# Altium schematic sheet Encoder_Interface.SchDoc
size A4; CompanyName: Technische Hochschule Nürnberg Georg Simon Ohm; Organization: UltraZohm; Address1: Kesslerplatz 12; Address2: 90489 Nürnberg; Address3: GERMANY; DocumentNumber: 3; SheetNumber: 3; SheetTotal: 3; Website: www.ultrazohm.com
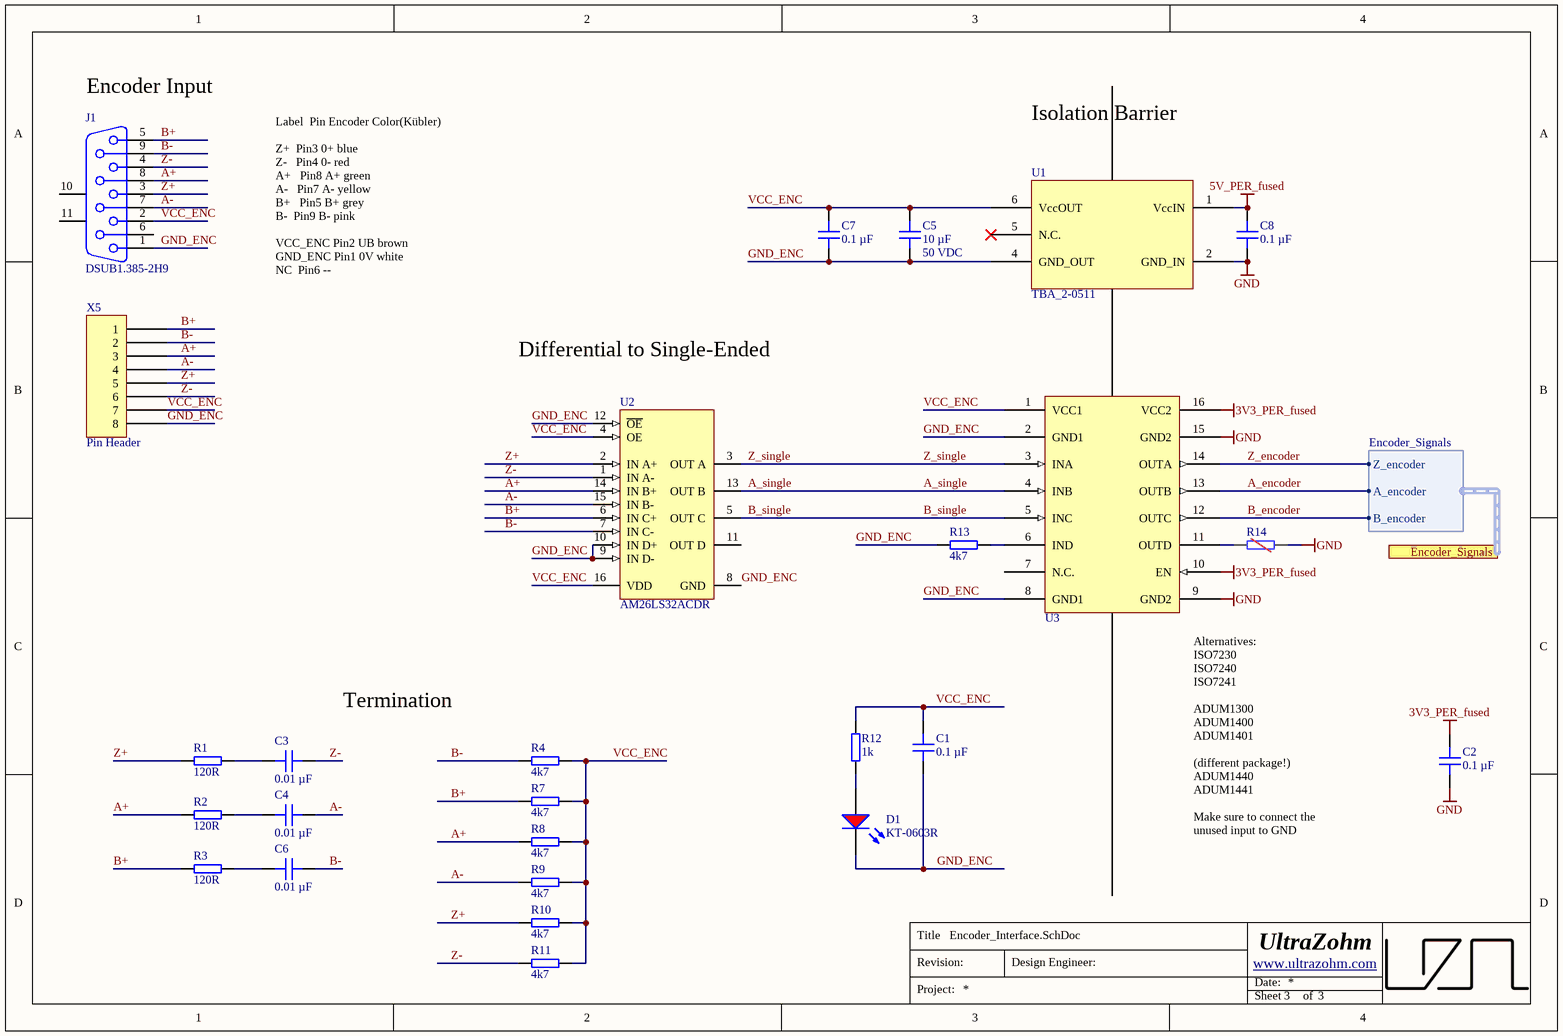
[diagram p0: Encoder_Interface.SchDoc]

## Parts
C1  0.1 µF  [C_0805]
C2  0.1 µF  [C_0805]
C3  0.01 µF  [C_0805]
C4  0.01 µF  [C_0805]
C5  10 µF  Voltage Rating: 50 VDC  [C_1206]
C6  0.01 µF  [C_0805]
C7  0.1 µF  [C_0805]
C8  0.1 µF  [C_0805]
D1  KT-0603R  [WL-SMCW_0603]
J1  DSUB1.385-2H9  [DSUB1.385-2H9]
R1  120R  [RES 0603_1608]
R2  120R  [RES 0603_1608]
R3  120R  [RES 0603_1608]
R4  4k7  [RES 0603_1608]
R7  4k7  [RES 0603_1608]
R8  4k7  [RES 0603_1608]
R9  4k7  [RES 0603_1608]
R10  4k7  [RES 0603_1608]
R11  4k7  [RES 0603_1608]
R12  1k  [RES 0603_1608]
R13  4k7  [RES 0603_1608]
R14  DNP  [R_0603_TE-DNP]  (value not drawn)  (no BOM)
U1  TBA_2-0511  [SIP7]
U2  AM26LS32ACDR  [D0016A_M]
U3  ISO7240MDWR  [SOIC-16]  (value not drawn)
X5  Pin Header  [HDR1X8]

## Ports
Encoder_Signals (harness Encoder_Signals)

## Harnesses
Encoder_Signals: A_encoder, B_encoder, Z_encoder

## Nets
3V3_PER_fused: C2.2 U3.10(EN) U3.16(VCC2)
5V_PER_fused: C8.2 U1.1(VccIN)
GND: C2.1 C8.1 R14.2 U1.2(GND_IN) U3.9(GND2) U3.15(GND2)
A+: J1.8 R2.1 R8.1 U2.14(IN_B+) X5.3
A-: C4.2 J1.7 R9.1 U2.15(IN_B-) X5.4
A_encoder: U3.13(OUTB) ; port Encoder_Signals.A_encoder
A_single: U2.13(OUT_B) U3.4(INB)
B+: J1.5 R3.1 R7.1 U2.6(IN_C+) X5.1
B-: C6.2 J1.9 R4.1 U2.7(IN_C-) X5.2
B_encoder: U3.12(OUTC) ; port Encoder_Signals.B_encoder
B_single: U2.5(OUT_C) U3.5(INC)
GND_ENC: C1.1 C5.1 C7.1 D1.1(K) J1.1 R13.1 U1.4(GND_OUT) U2.8(GND) U2.9(IN_D-) U2.10(IN_D+) U2.12(~{OE}) U3.2(GND1) U3.8(GND1) X5.8
VCC_ENC: C1.2 C5.2 C7.2 J1.2 R4.2 R7.2 R8.2 R9.2 R10.2 R11.2 R12.2 U1.6(VccOUT) U2.4(OE) U2.16(VDD) U3.1(VCC1) X5.7
Z+: J1.3 R1.1 R10.1 U2.2(IN_A+) X5.5
Z-: C3.2 J1.4 R11.1 U2.1(IN_A-) X5.6
Z_encoder: U3.14(OUTA) ; port Encoder_Signals.Z_encoder
Z_single: U2.3(OUT_A) U3.3(INA)
NetC3_1: C3.1 R1.2
NetC4_1: C4.1 R2.2
NetC6_1: C6.1 R3.2
NetD1_2: D1.2(A) R12.1
NetR13_2: R13.2 U3.6(IND)
NetR14_1: R14.1 U3.11(OUTD)

Not connected (* = marked no-connect by the designer): J1 6 10(MH1) 11(MH2); U1 5(N.C.)*; U2 11(OUT_D); U3 7(N.C.)

## Notes on the sheet
- (near J1) Encoder Input
- Isolation Barrier
- Label		Pin	Encoder	Color(Kübler)
  Z+		Pin3	0+	blue
  Z- 		Pin4	0-	red
  A+ 		Pin8	A+	green
  A- 		Pin7	A-	yellow
  B+ 		Pin5	B+	grey
  B-		Pin9	B-	pink
  VCC_ENC	Pin2	UB	brown
  GND_ENC	Pin1	0V	white
  NC		Pin6	--
- Differential to Single-Ended
- Termination
- (near U3) Alternatives:
  ISO7230
  ISO7240
  ISO7241
  ADUM1300
  ADUM1400
  ADUM1401
  (different package!)
  ADUM1440
  ADUM1441
  Make sure to connect the unused input to GND
- Title
- Revision:
- Design Engineer:
- Date:
- Project:
- Sheet
- of

## Library data of the parts
C1 C2 C7 C8 = C0805C104J5RECTU: Capacitor 0805, 50 VDC, 0.1 µF, X7R; Manufacturer: KEMET; Tolerance: 5 %; Voltage Rating: 50 VDC; Created from: MGremer; Manufacturer Part Number: C0805C104J5RECTU; PartID: 17; Created On: 20.12.2020 13:54:13; ComponentLink1Description: Datasheet; ComponentLink1URL: https://www.mouser.de/datasheet/2/212/KEM_C1002_X7R_SMD-1102033.pdf; Component Type: Capacitor 0805; Device Package: 0805; Last Updated: 27.05.2022 20:15:41; Mounting Type: SMD; Operating Temperature: -55 - 125°C; Series: SMD Comm X7R; Supplier 1: Mouser; Supplier Part Number 1: 80-C0805C104J5RECTU; Type: Capacitor; Value: 0.1 µF; Live Cycle Status: 1; Stock number: Labor SMD Container; LCSC Part Number: C49678
C3 C4 C6 = C0805X103K5RAC3316: Capacitor 0805, 50 VDC, 0.01 µF, X7R; Manufacturer: KEMET; Tolerance: 10 %; Voltage Rating: 50 VDC; Created from: MGremer; Manufacturer Part Number: C0805X103K5RAC3316; PartID: 21; Created On: 20.12.2020 13:54:13; ComponentLink1Description: Datasheet; ComponentLink1URL: https://www.mouser.de/datasheet/2/212/KEM_X7R_FT_VW_AUDI-1775098.pdf; Component Type: Capacitor 0805; Device Package: 0805; Last Updated: 27.05.2022 20:11:47; Mounting Type: SMD; Operating Temperature: -55 - 125°C; Series: SMD Comm X7R; Supplier 1: Mouser; Supplier Part Number 1: 80-C0805X103K5RC3316; Type: Capacitor; Value: 0.01 µF; Live Cycle Status: 1; Stock number: Labor SMD Container; LCSC Part Number: C1710
C5 = CGA5L1X7R1H106K160AC: Capacitor 1206, 50 VDC, 10 µF, X7R; Manufacturer: TDK; Tolerance: 10 %; Created from: MGremer; Manufacturer Part Number: CGA5L1X7R1H106K160AC; PartID: 25; Created On: 20.12.2020 13:54:13; ComponentLink1Description: Datasheet; ComponentLink1URL: https://product.tdk.com/info/en/catalog/datasheets/mlcc_automotive_general_en.pdf; Component Type: Capacitor 1206; Device Package: 1206; Last Updated: 27.05.2022 14:15:21; Mounting Type: SMD; Operating Temperature: -55 - 125°C; Series: CGA; Supplier 1: Mouser; Supplier Part Number 1: 810-CGA5L1X7R1H106K1; Type: Capacitor; Value: 10 µF; Live Cycle Status: 1; LCSC Part Number: C13585; Stock number: Labor SMD Container
D1 = KT-0603R: LED RED 520~625NM 90~100MCD@20MA TOP VIEW 0603 ROHS; Manufacturer: Hubei KENTO Elec; Type: Standard; Created from: T. Wendt; Forward Current I_f: 20 mA; Forward Voltage U_f: 2.1 V; Wavelength: 620 nm; Light Intensity: 110 mcd; Nominal Power: 42 mW; Manufacturer Part Number: KT-0603R; PartID: 8; Created On: 03.03.2021 10:06:23; ComponentLink1Description: Datasheet; ComponentLink1URL: https://datasheet.lcsc.com/szlcsc/Hubei-KENTO-Elec-KT-0603R_C2286.pdf; Component Type: LED Diode; Device Package: 0603; Last Updated: 04.03.2021 09:02:49; Mounting Type: SMD; Operating Temperature: -40 - 85 °C; Supplier 1: LCSC; Supplier Part Number 1: C2286; Live Cycle Status: 1; Stock number: not stored; Color: red; LCSC Part Number: C2286
J1 = DSUB1.385-2H9: Connector; D Subminiature; 9 Position; Right Angle; Pitch 1.385 mm; Manufacturer: TE Connectivity; PackageDocument: O; Positions: 9; Gender: Receptacle; Created from: MHlatky; Published: 15-Jun-2001; LatestRevisionDate: 17-Jul-2002; LatestRevisionNote: Re-released for DXP Platform.; DatasheetDocument: 1-Sep-1999; PackageReference: 788750; Publisher: Altium Limited; Orientation: Right Angle; Manufacturer Part Number: DSUB1.385-2H9; PartID: 5; Created On: 26.01.2021 09:19:51; ComponentLink1Description: Datasheet; ComponentLink1URL: https://www.mouser.de/datasheet/2/418/7/ENG_CD_2311765_D-2072985.pdf; Component Type: DSUB Connector; Device Package: -; Last Updated: 27.05.2022 15:54:50; Type: DSUB Connector; Live Cycle Status: 1; Stock number: not stored; Supplier 1: Mouser; Supplier Part Number 1: 571-2311765-1; LCSC Part Number: C141882
R1-R3 = RK73B1JTTD121J: SMD resistor E24 series; Manufacturer: KOA Speer; Tolerance: 5%; Created from: MGremer; Manufacturer Part Number: RK73B1JTTD121J; PartID: 52; Created On: 14.12.2020 16:17:14; ComponentLink1Description: Datasheet; ComponentLink1URL: https://www.mouser.de/datasheet/2/219/RK73B-1825463.pdf; Component Type: SMD resistor; Device Package: 0603; Last Updated: 27.05.2022 13:40:47; Mounting Type: SMD; Supplier 1: Mouser; Supplier Part Number 1: 660-RK73B1JTTD121J; Type: Resistor; Value: 120R; Live Cycle Status: 1; Stock number: Labor SMD Container; LCSC Part Number: C22787
R4 R7-R11 R13 = RK73B1JTTD472J: SMD resistor E24 series; Manufacturer: KOA Speer; Tolerance: 5%; Created from: MGremer; Manufacturer Part Number: RK73B1JTTD472J; PartID: 90; Created On: 14.12.2020 16:17:14; ComponentLink1Description: Datasheet; ComponentLink1URL: https://www.mouser.de/datasheet/2/219/RK73B-1825463.pdf; Component Type: SMD resistor; Device Package: 0603; Last Updated: 27.05.2022 13:46:16; Mounting Type: SMD; Supplier 1: Mouser; Supplier Part Number 1: 660-RK73B1JTTD472J; Type: Resistor; Value: 4k7; Live Cycle Status: 1; Stock number: Labor SMD Container; LCSC Part Number: C23162
R12 = RK73B1JTTDD102J: SMD resistor E24 series; Manufacturer: KOA Speer; Tolerance: 5%; Created from: MGremer; Manufacturer Part Number: RK73B1JTTDD102J; PartID: 74; Created On: 14.12.2020 16:17:14; ComponentLink1Description: Datasheet; ComponentLink1URL: https://www.mouser.de/datasheet/2/219/RK73B-1825463.pdf; Component Type: SMD resistor; Device Package: 0603; Last Updated: 27.05.2022 13:40:21; Mounting Type: SMD; Supplier 1: Mouser; Supplier Part Number 1: 660-RK73B1JTTDD102J; Type: Resistor; Value: 1k; Live Cycle Status: 1; Stock number: Labor SMD Container; LCSC Part Number: C21190
R14 = UZgen_R_0603_DNP: Generic resistor (DNP); Manufacturer: UZgen; Created from: UZgenTool; Manufacturer Part Number: UZgen_R_0603_DNP; PartID: 593; Created On: 25/03/2025 14:26:15; Value: DNP; Device Package: 0603; Tolerance: -; Mounting Type: SMD; Last Updated: 02/04/2025 19:05:00
U1 = TBA_2-0511: 4.5-5.5 V Input, 5 V @ 400 mA Output, 2 W, isolated DC/DC-converter; Manufacturer: TRACO Power; Created from: TGaupp; Manufacturer Part Number: TBA_2-0511; PartID: 25; Created On: 28/04/2026 12:30:53; ComponentLink1Description: Datasheet; ComponentLink1URL: https://www.tracopower.com/tba2-datasheet; Component Type: Isolated DC/DC; Device Package: 19.55mm x 7.6 mm x 10.2 mm; Last Updated: 28/04/2026 12:43:25; Mounting Type: THT; Operating Temperature: -40 - 80 °C; Supplier 1: LCSC; Supplier Part Number 1: C6329167; Type: Isolated DC/DC; Live Cycle Status: 1; LCSC Part Number: C6329167; Stock number: not stored
U2 = AM26LS32ACDR: AM26LS32Ax, AM26LS33Ax Quadruple Differential Line Receivers; PartNumber: DS26LS32ACM; Manufacturer: Texas Instruments; PackageTopMarking: NSUZXYTTE#*DS26LS32*ACM; PowerWise: N; CompType: Interface IC; Created from: MHlatky; Published: 4-Dec-2008; DatasheetVersion: May-1999; PackageVersion: revJ, Aug-1995; PackageReference: M16A; Publisher: Altium Limited; PackageDescription: Molded Package, SO, .150in Wide, 16 Lead; Supplier 1: Mouser; Supplier Part Number 1: 595-AM26LS32ACDR; RoHS: N; PinCount: 16; Code_JEDEC: MS-012-AC; Code_IPC: SOIC127P600-16; ComponentLink1Description: Datasheet; ComponentLink1URL: https://www.ti.com/lit/ds/symlink/am26ls32ac.pdf; ComponentLink2Description: DS26LS32AC Web Page; ComponentLink2URL: http://www.national.com/pf/DS/DS26LS32AC.html; ComponentLink3Description: M16A Package Page; ComponentLink3URL: http://www.national.com/packaging/folders/m16a.html; Manufacturer Part Number: AM26LS32ACDR; PartID: 14; Created On: 26.01.2021 09:03:43; Component Type: Quad Diff. Receiver; Last Updated: 27.05.2022 17:40:36; Mounting Type: SMT; Operating Temperature: 0 - 70 °C; Type: Diff Line Receivers; Live Cycle Status: 1; Stock number: not stored; LCSC Part Number: C6180
U3 = ISO7240MDWR: ISO7240x Quad Ch 4  150Mbps Digital Isolator; Manufacturer: Texas Instruments; Created from: TGaupp; Manufacturer Part Number: ISO7240MDWR; PartID: 18; Created On: 06/05/2026 09:53:28; ComponentLink1Description: Datasheet; ComponentLink1URL: https://www.ti.com/lit/ds/symlink/iso7240m.pdf?ts=1777988403849&ref_url=https%253A%252F%252Fwww.mouser.de%252F; Component Type: Digital Isolator; Device Package: SOIC-16; Last Updated: 06/05/2026 10:10:35; Mounting Type: SMD; Operating Temperature: -40 to +125 °C; Series: ISO7240; Supplier 1: Mouser; Supplier Part Number 1: 595-ISO7240MDWR; Supplier 2: LCSC; Supplier Part Number 2: C37709; Type: Digital Isolator; Value: ISO7240MDWR; LCSC Part Number: C37709
X5 = 103741-8: 8 Pin; Manufacturer: TE Connectivity; Created from: MHlatky; Manufacturer Part Number: 103741-8; PartID: 9; Created On: 22.11.2021 15:31:45; ComponentLink1Description: Datasheet; ComponentLink1URL: https://www.mouser.de/datasheet/2/427/VISH_S_A0003529023_1-2568887.pdf; Component Type: Pin Header; Last Updated: 21.03.2022 12:19:22; Supplier 1: Mouser; Supplier Part Number 1: 571-103741-8; Type: Pin Header; Live Cycle Status: 1; Stock number: not stored